# EAGLE design Front_DB_handrouted (EAGLE 9.1.3)
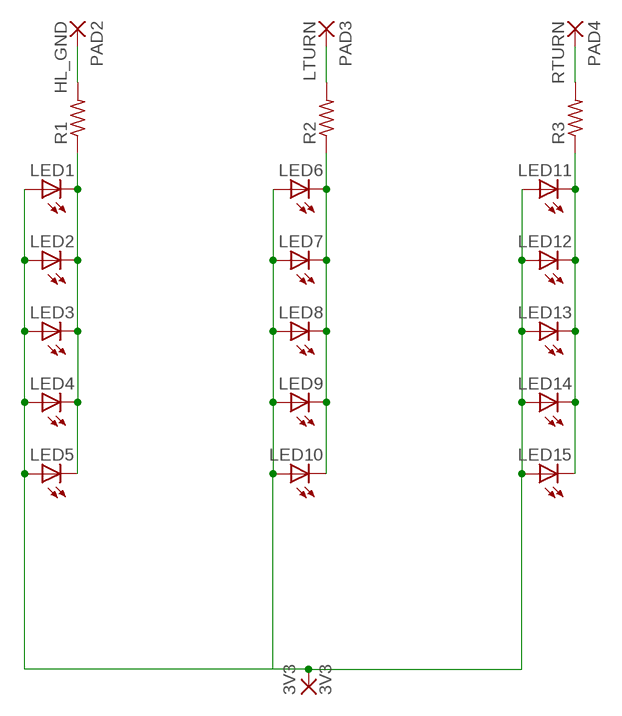
[diagram p0: schematic, sheet 1]

## Parts
3V3  3V3  2,54/1,1  [2,54/1,1]
LED1  LEDMICRO-SIDELED  [MICRO-SIDELED]
LED2  LEDMICRO-SIDELED  [MICRO-SIDELED]
LED3  LEDMICRO-SIDELED  [MICRO-SIDELED]
LED4  LEDMICRO-SIDELED  [MICRO-SIDELED]
LED5  LEDMICRO-SIDELED  [MICRO-SIDELED]
LED6  LEDCHIPLED_0603  [CHIPLED_0603]
LED7  LEDCHIPLED_0603  [CHIPLED_0603]
LED8  LEDCHIPLED_0603  [CHIPLED_0603]
LED9  LEDCHIPLED_0603  [CHIPLED_0603]
LED10  LEDCHIPLED_0603  [CHIPLED_0603]
LED11  LEDCHIPLED_0603  [CHIPLED_0603]
LED12  LEDCHIPLED_0603  [CHIPLED_0603]
LED13  LEDCHIPLED_0603  [CHIPLED_0603]
LED14  LEDCHIPLED_0603  [CHIPLED_0603]
LED15  LEDCHIPLED_0603  [CHIPLED_0603]
PAD2  HL_GND  2,54/1,1  [2,54/1,1]
PAD3  LTURN  2,54/1,1  [2,54/1,1]
PAD4  RTURN  2,54/1,1  [2,54/1,1]
R1  R-US_R0805  [R0805]
R2  R-US_R0805  [R0805]
R3  R-US_R0805  [R0805]

## Nets
N$1: LED1.C LED2.C LED3.C LED4.C LED5.C R1.1
N$2: LED6.C LED7.C LED8.C LED9.C LED10.C R2.1
N$3: LED11.C LED12.C LED13.C LED14.C LED15.C R3.1
N$4: PAD4.1(P) R3.2
N$5: PAD3.1(P) R2.2
N$6: 3V3.1(P) LED1.A LED2.A LED3.A LED4.A LED5.A LED6.A LED7.A LED8.A LED9.A LED10.A LED11.A LED12.A LED13.A LED14.A LED15.A
N$7: PAD2.1(P) R1.2

## Library data of the parts
3V3 PAD2-PAD4 = wirepad:2,54/1,1: THROUGH-HOLE PAD
LED1-LED15 = adafruit:LED: LED OSRAM: - CHIPLED LG R971, LG N971, LY N971, LG Q971, LY Q971, LO R971, LY R971 LH N974, LH R974 LS Q976, LO Q976, LY Q976 LO Q996 - Hyper CHIPLED LW Q18S LB Q993, LB Q99A, LB R99A - SideLED LS A670, LO A670, LY A670, LG A670, LP A670 LB A673, LV A673, LT A673, LW A673 LH A674 LY A675 LS A676, LA A676, LO A676, LY A676, LW A676 LS A679, LY A679, LG A679 - Hyper Micro SIDELED® LS Y876, LA Y876, LO Y876, LY Y876 LT Y87S - SmartLED LW L88C, LW L88S LB L89C, LB L89S, LG L890 LS L89K, LO L89K, LY L89K LS L896, LA L896, LO L896, LY L896 - TOPLED LS T670, LO T670, LY T670, LG T670, LP T670 LSG T670, LSP T670, LSY T670, LOP T670, LYG T670 LG T671, LOG T671, LSG T671 LB T673, LV T673, LT T673, LW T673 LH T674 LS T676, LA T676, LO T676, LY T676, LB T676, LH T676, LSB T676, LW T676 LB T67C, LV T67C, LT T67C, LS T67K, LO T67K, LY T67K, LW E67C LS E67B, LA E67B, LO E67B, LY E67B, LB E67C, LV E67C, LT E67C LW T67C LS T679, LY T679, LG T679 LS T770, LO T770, LY T770, LG T770, LP T770 LB T773, LV T773, LT T773, LW T773 LH T774 LS E675, LA E675, LY E675, LS T675 LS T776, LA T776, LO T776, LY T776, LB T776 LHGB T686 LT T68C, LB T68C - Hyper Mini TOPLED® LB M676 - Mini TOPLED Santana® LG M470 LS M47K, LO M47K, LY M47K Source: http://www.osram.convergy.de/
R1-R3 = adafruit:R-US_: RESISTOR, American symbol

## Board
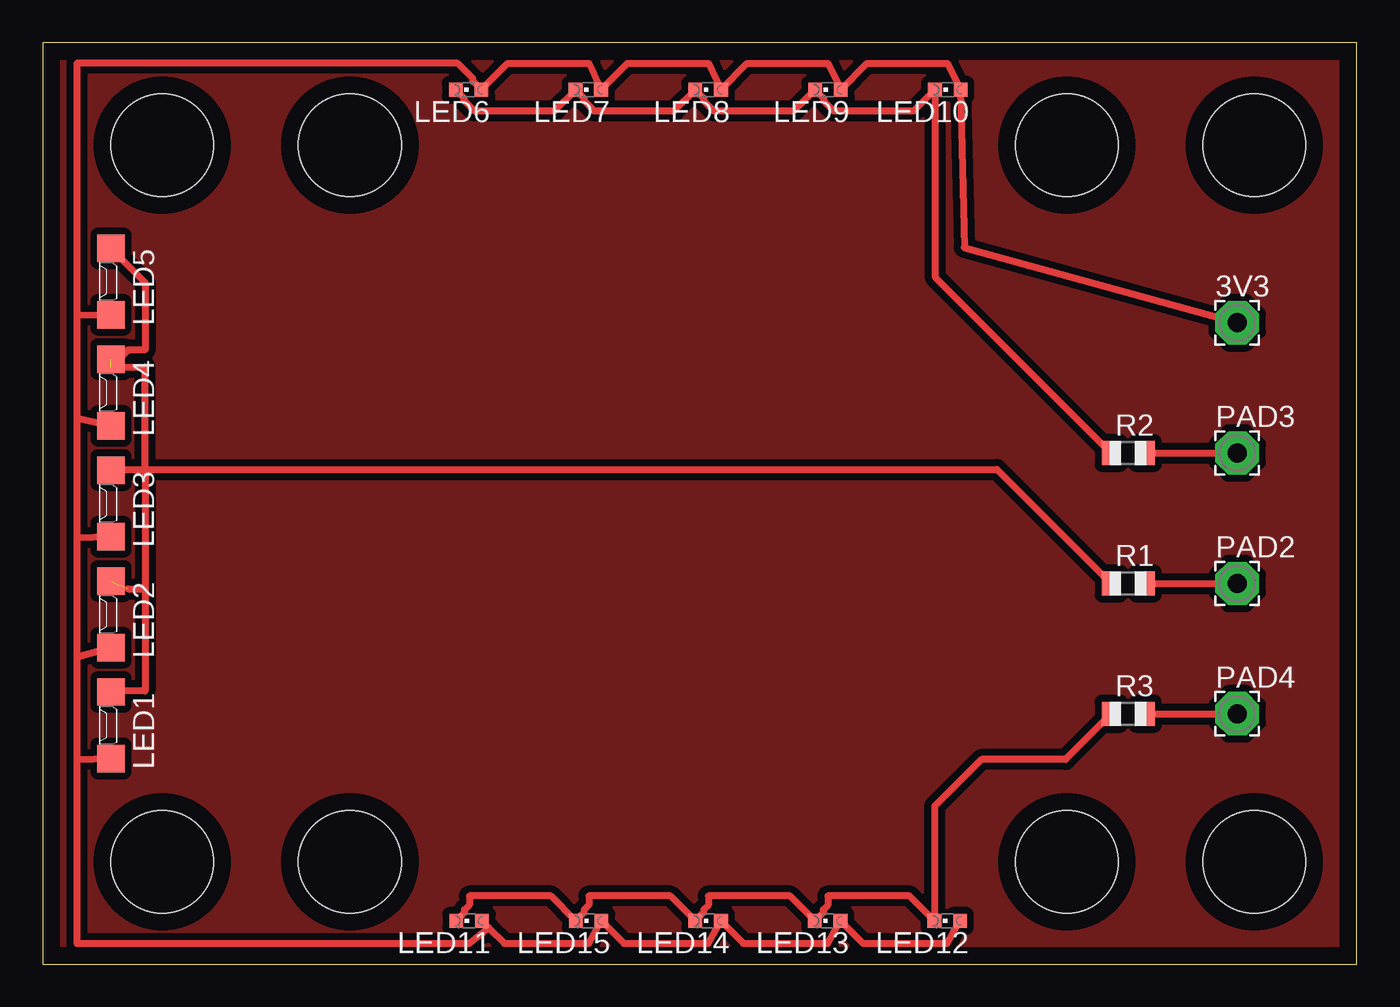
[diagram p1: board, top side]
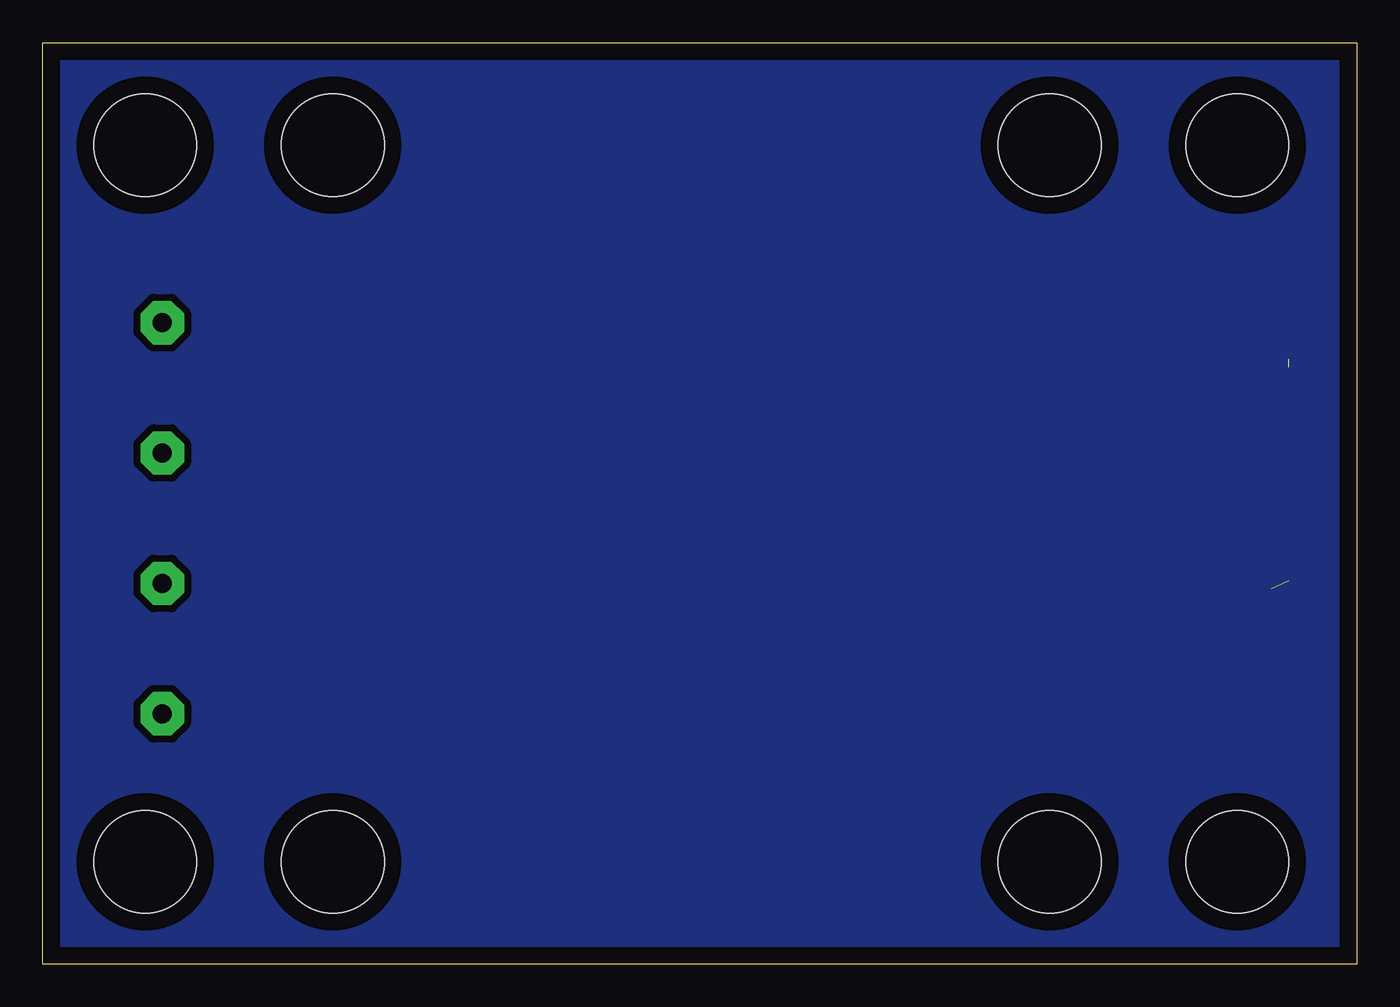
[diagram p2: board, bottom side, seen from below]

Size 77 x 54 mm. Coordinates in mm from the lower left corner, seen from the top.
Outline: 0,0 77,0 77,54 0,54 0,0
Copper layers (1*16): Top 0.035mm / dielectric 1.5mm / Bottom 0.035mm
Design rules "default *": minimum track width 16mil, minimum drill 0.35mm, track to track 16mil, track to pad 16mil, pad to pad 16mil, via to via 16mil, smd to smd 16mil, copper to edge 40mil, drill to drill 6mil, minimum pad ring 10mil, minimum via ring 8mil, stop-mask expansion 4mil, vias tented up to drill 0mil, thermal gap 10mil
Holes 6 mm at 7,6 18,6 60,6 71,6 7,48 18,48 60,48 71,48

### Footprints (pad centres in the part's own frame; a part is rotated, then mirrored left to right if it is on the bottom)
2,54/1,1 = drill 1.118 pad 2.54 octagon: 1 0,0
MICRO-SIDELED = smd 1.6 x 1.6: A 0,1.95; C 0,-1.95
CHIPLED_0603 = smd 0.8 x 0.8: A 0,-0.75; C 0,0.75
R0805 = smd 1.1 x 1.4: 1 -1,0; 2 1,0

### Placement (x,y rotation side)
3V3  69.99,37.59 0 top
LED1  4,14 180 top
LED2  4,20.5 180 top
LED3  4,27 180 top
LED4  4,33.5 180 top
LED5  4,40 180 top
LED6  24.95,51.24 90 top
LED7  31.97,51.24 90 top
LED8  38.99,51.24 90 top
LED9  46.01,51.24 90 top
LED10  53.03,51.24 90 top
LED11  24.98,2.54 90 top
LED12  53,2.54 90 top
LED13  45.99,2.54 90 top
LED14  38.99,2.54 90 top
LED15  31.98,2.54 90 top
PAD2  69.99,22.31 0 top
PAD3  69.99,29.95 0 top
PAD4  69.99,14.67 0 top
R1  63.6,22.31 0 top
R2  63.6,29.95 0 top
R3  63.6,14.67 0 top

### Tracks (layer width: path | path; a pad name or v marks a point on that pad's centre or on a via)
3V3
  pour Top: 0,54 77,54 77,0 0,0
  pour Bottom: 0,54 77,54 77,0 0,0
N$1  (2 unrouted)
  Top 0.406: LED5.C 6,39.95 6,36 5,36 4,35 6,35 6,29 | LED3.C 4.05,29 6,29 | 6,29 6,22 | 5,22 6,22 | 6,22 6,16 4.05,16 LED1.C | 6,29 55.91,29 R1.1
N$2
  Top 0.406: LED6.C 24.69,50.75 24.69,50.59 25.28,50 30,50 31.22,51.22 LED7.C 31.71,50.75 31.71,50.59 32.3,50 37,50 LED8.C 38.73,50.75 38.73,50.59 39.32,50 44.02,50 LED9.C 45.75,50.75 45.75,50.59 46.34,50 51.04,50 LED10.C 52.28,40.27 R2.1
N$3
  Top 0.406: R3.1 59.93,12 55,12 52.25,9.25 LED12.C 50.79,4 46,4 46,3.46 45.73,3.19 45.73,3.03 LED13.C 43.78,4 39,4 39,3.46 38.73,3.19 38.73,3.03 LED14.C 36.78,4 32,4 32,3.47 31.73,3.19 31.73,3.03 LED15.C 29.77,4 25,4 25,3.47 24.72,3.19 24.72,3.03 LED11.C
N$4
  Top 0.406: R3.2 PAD4.1
N$5
  Top 0.406: R2.2 PAD3.1
N$6
  Top 0.406: LED5.A 2,38 | 2,38 2,32 | 2,32 LED4.A | 2,32 2,25 | 2,25 LED3.A | 2,25 2,18 | 2,18 LED2.A | 2,18 2,12 | 2,12 LED1.A | LED11.A 26.14,2.13 | 26.14,2.13 27.05,1.22 32,1.22 LED15.A 34.06,1.22 39,1.22 LED14.A 41.06,1.22 46,1.22 LED13.A 48.07,1.22 53,1.22 LED12.A | 3V3.1 54,42 LED10.A 53,52.78 48.3,52.78 LED9.A 46,52.78 41.28,52.78 LED8.A 39,52.78 34.26,52.78 LED7.A 32,52.78 27.24,52.78 LED6.A 25.21,51.73 25.21,51.89 24.32,52.78 2,52.78 2,38 | 2,12 2,1.22 25,1.22 26.14,2.13
N$7
  Top 0.406: R1.2 PAD2.1